# EAGLE schematic MARK (EAGLE 9.3.0)
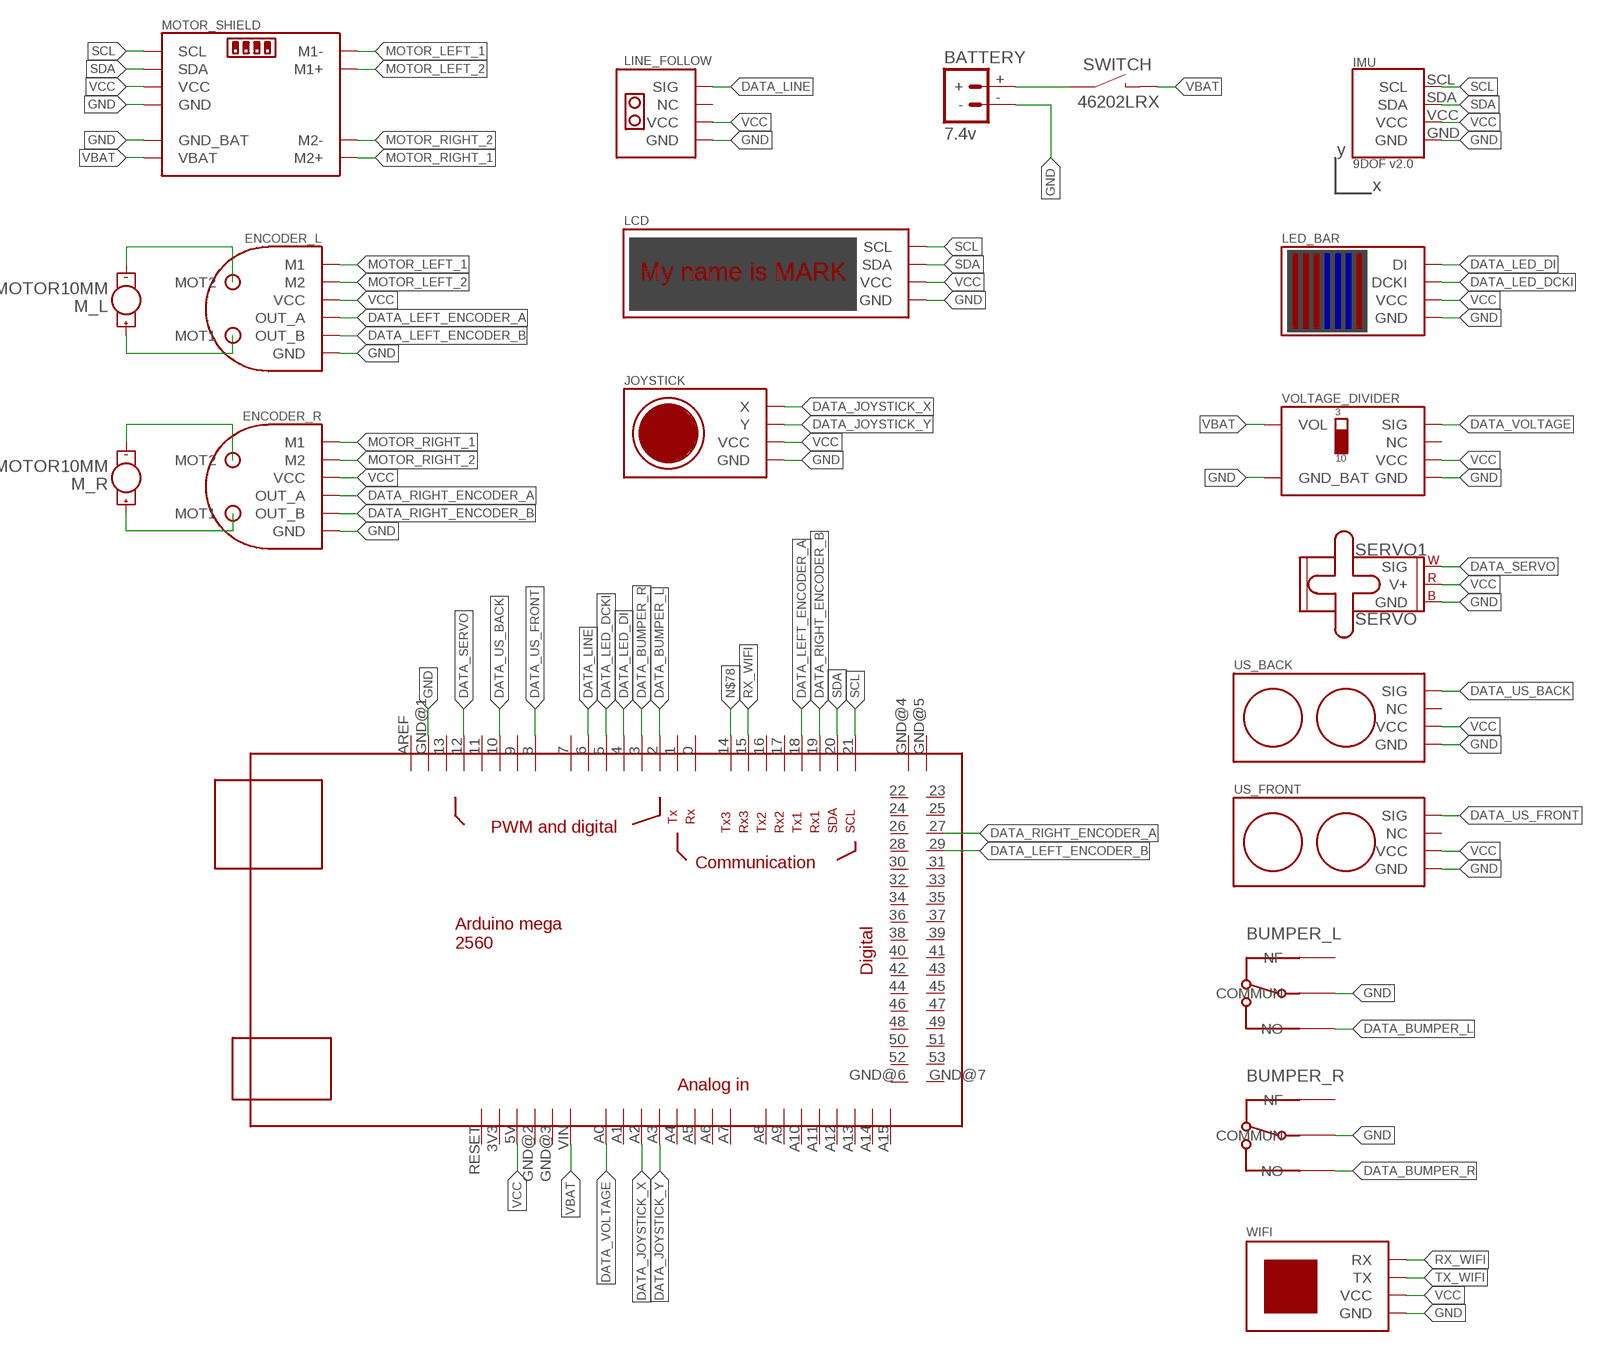
[diagram p0: schematic, sheet 1]

## Parts
BATTERY  7.4v  BATTERY_CONN_DEANS  [DEANS]
BUMPER_L  MICROSWITCHCOUDE  [DG23-B3RA]
BUMPER_R  MICROSWITCHCOUDE  [DG23-B3RA]
ENCODER_L  MOTOR  [MOTOR]
ENCODER_R  MOTOR  [MOTOR]
IMU  IMU  [IMU]
JOYSTICK  JOYSTICK  [JOYSTICK]
LCD  LCD  [LCD]
LED_BAR  LED_BAR  [LED_BAR]
LINE_FOLLOW  INFRARED  [INFRARED]
M_L  MOTOR10MM  [VIBE-MOTOR-10MM]
M_R  MOTOR10MM  [VIBE-MOTOR-10MM]
MOTOR_SHIELD  MOTOR_SHIELD  [MOTOR_SHIELD]
SERVO1  SERVO  [1X03]
SWITCH  46202LRX  [46202LRX]
U$11  MEGA_DEVICE  [MEGAOUTLINE]
US_BACK  ULTRASONIC  [ULTRASONIC]
US_FRONT  ULTRASONIC  [ULTRASONIC]
VOLTAGE_DIVIDER  VOLTAGE_DIVIDER  [VOLTAGE_DIVIDER]
WIFI  WIFI  [WIFI]

## Nets
DATA_BUMPER_L: BUMPER_L.NO U$11.2
DATA_BUMPER_R: BUMPER_R.NO U$11.3
DATA_JOYSTICK_X: JOYSTICK.X U$11.A2
DATA_JOYSTICK_Y: JOYSTICK.Y U$11.A3
DATA_LED_DCKI: LED_BAR.DCKI U$11.5
DATA_LED_DI: LED_BAR.DI U$11.4
DATA_LEFT_ENCODER_A: ENCODER_L.OUT_A U$11.18
DATA_LEFT_ENCODER_B: ENCODER_L.OUT_B U$11.29
DATA_LINE: LINE_FOLLOW.SIG U$11.6
DATA_RIGHT_ENCODER_A: ENCODER_R.OUT_A U$11.27
DATA_RIGHT_ENCODER_B: ENCODER_R.OUT_B U$11.19
DATA_SERVO: SERVO1.1(SIG) U$11.12
DATA_US_BACK: U$11.10 US_BACK.SIG
DATA_US_FRONT: U$11.8 US_FRONT.SIG
DATA_VOLTAGE: U$11.A0 VOLTAGE_DIVIDER.3(SIG)
GND: BATTERY.- BUMPER_L.COMMUN BUMPER_R.COMMUN ENCODER_L.GND ENCODER_R.GND IMU.GND JOYSTICK.GND LCD.GND LED_BAR.GND LINE_FOLLOW.GND MOTOR_SHIELD.GND MOTOR_SHIELD.GND_BAT SERVO1.3(GND) U$11.GND@1(GND) US_BACK.GND US_FRONT.GND VOLTAGE_DIVIDER.2(GND_BAT) VOLTAGE_DIVIDER.6(GND) WIFI.GND
MOTOR_LEFT_1: ENCODER_L.M1 MOTOR_SHIELD.M1-
MOTOR_LEFT_2: ENCODER_L.M2 MOTOR_SHIELD.M1+
MOTOR_RIGHT_1: ENCODER_R.M1 MOTOR_SHIELD.M2+
MOTOR_RIGHT_2: ENCODER_R.M2 MOTOR_SHIELD.M2-
N$1: ENCODER_R.MOT2 M_R.-
N$2: BATTERY.+ SWITCH.P$1(A1)
N$3: ENCODER_R.MOT1 M_R.+
N$5: ENCODER_L.MOT1 M_L.+
N$6: ENCODER_L.MOT2 M_L.-
N$78: U$11.14
RX_WIFI: U$11.15 WIFI.RX
SCL: IMU.SCL LCD.SCL MOTOR_SHIELD.SCL U$11.21
SDA: IMU.SDA LCD.SDA MOTOR_SHIELD.SDA U$11.20
TX_WIFI: WIFI.TX
VBAT: MOTOR_SHIELD.VBAT SWITCH.P$2(B) U$11.VIN VOLTAGE_DIVIDER.1(VOL)
VCC: ENCODER_L.VCC ENCODER_R.VCC IMU.VCC JOYSTICK.VCC LCD.VCC LED_BAR.VCC LINE_FOLLOW.VCC MOTOR_SHIELD.VCC SERVO1.2(V+) U$11.5V US_BACK.VCC US_FRONT.VCC VOLTAGE_DIVIDER.5(VCC) WIFI.VCC
Unconnected: BUMPER_L.NF BUMPER_R.NF LINE_FOLLOW.NC U$11.0 U$11.1 U$11.3V3 U$11.7 U$11.9 U$11.11 U$11.13 U$11.16 U$11.17 U$11.22 U$11.23 U$11.24 U$11.25 U$11.26 U$11.28 U$11.30 U$11.31 U$11.32 U$11.33 U$11.34 U$11.35 U$11.36 U$11.37 U$11.38 U$11.39 U$11.40 U$11.41 U$11.42 U$11.43 U$11.44 U$11.45 U$11.46 U$11.47 U$11.48 U$11.49 U$11.50 U$11.51 U$11.52 U$11.53 U$11.A1 U$11.A4 U$11.A5 U$11.A6 U$11.A7 U$11.A8 U$11.A9 U$11.A10 U$11.A11 U$11.A12 U$11.A13 U$11.A14 U$11.A15 U$11.AREF U$11.GND@2(GND) U$11.GND@3(GND) U$11.GND@4(GND) U$11.GND@5(GND) U$11.GND@6(GND) U$11.GND@7(GND) U$11.RESET US_BACK.NC US_FRONT.NC VOLTAGE_DIVIDER.4(NC)

## Library data of the parts
BATTERY = SparkFun-Connectors:BATTERY_CONN: Battery Connectors Various footprints for battery connections SparkFun Products: Deans Connector -M/F Pair <https://www.sparkfun.com/products/11864>; SF_ID: PRT-11864
BUMPER_L BUMPER_R = Clean-Kong:MICROSWITCH
ENCODER_L ENCODER_R = MARK:MOTOR
IMU = MARK:IMU
JOYSTICK = MARK:JOYSTICK
LCD = MARK:LCD
LED_BAR = MARK:LED_BAR
LINE_FOLLOW = MARK:INFRARED: Here is an infrared sensor from grove. That is a black box with only the connectors.
M_L M_R = SparkFun-Electromechanical:MOTOR: Motor (Single-Phase) Two-terminal, single-phase motors. SparkFun Products Vibration Motor <https://www.sparkfun.com/products/8449> (ROB-08449) Physical dimension and wire connections for this powerful vibration motor. Motor has a self adhesive backing.; PROD_ID: COMP-08572; SF_SKU: ROB-08449
MOTOR_SHIELD = MARK:MOTOR_SHIELD
SERVO1 = SparkFun-Electromechanical:SERVO: Servo Motor 3-pin connector for a standard servo motor (voltage supply, ground, and control signal.) SparkFun Products Servo - Generic (Sub-Micro Size) <https://www.sparkfun.com/products/9065> (ROB-09065) Servo - Generic High Torque Continuous Rotation (Standard Size) <https://www.sparkfun.com/products/9347> (ROB-09347) Servo - Generic High Torque (Standard Size) <https://www.sparkfun.com/products/11965> (ROB-11965)
SWITCH = DC_LOAD_AU:46202LRX: 46202LRX Switch
U$11 = ArduinoMegaOutline:MEGA_DEVICE: mega card as device
US_BACK US_FRONT = MARK:ULTRASONIC
VOLTAGE_DIVIDER = MARK:VOLTAGE_DIVIDER
WIFI = MARK:WIFI